# Altium schematic sheet Displays.SchDoc: Displays
size A4; Date: 2022 Fall; Address1: LK Bulls; Address2: Bagoly Zoltan; Address3: Feher Daniel; Address4: G. Varga Gabor; DocumentNumber: 4; Revision: 1.0; SheetNumber: 4; SheetTotal: 14
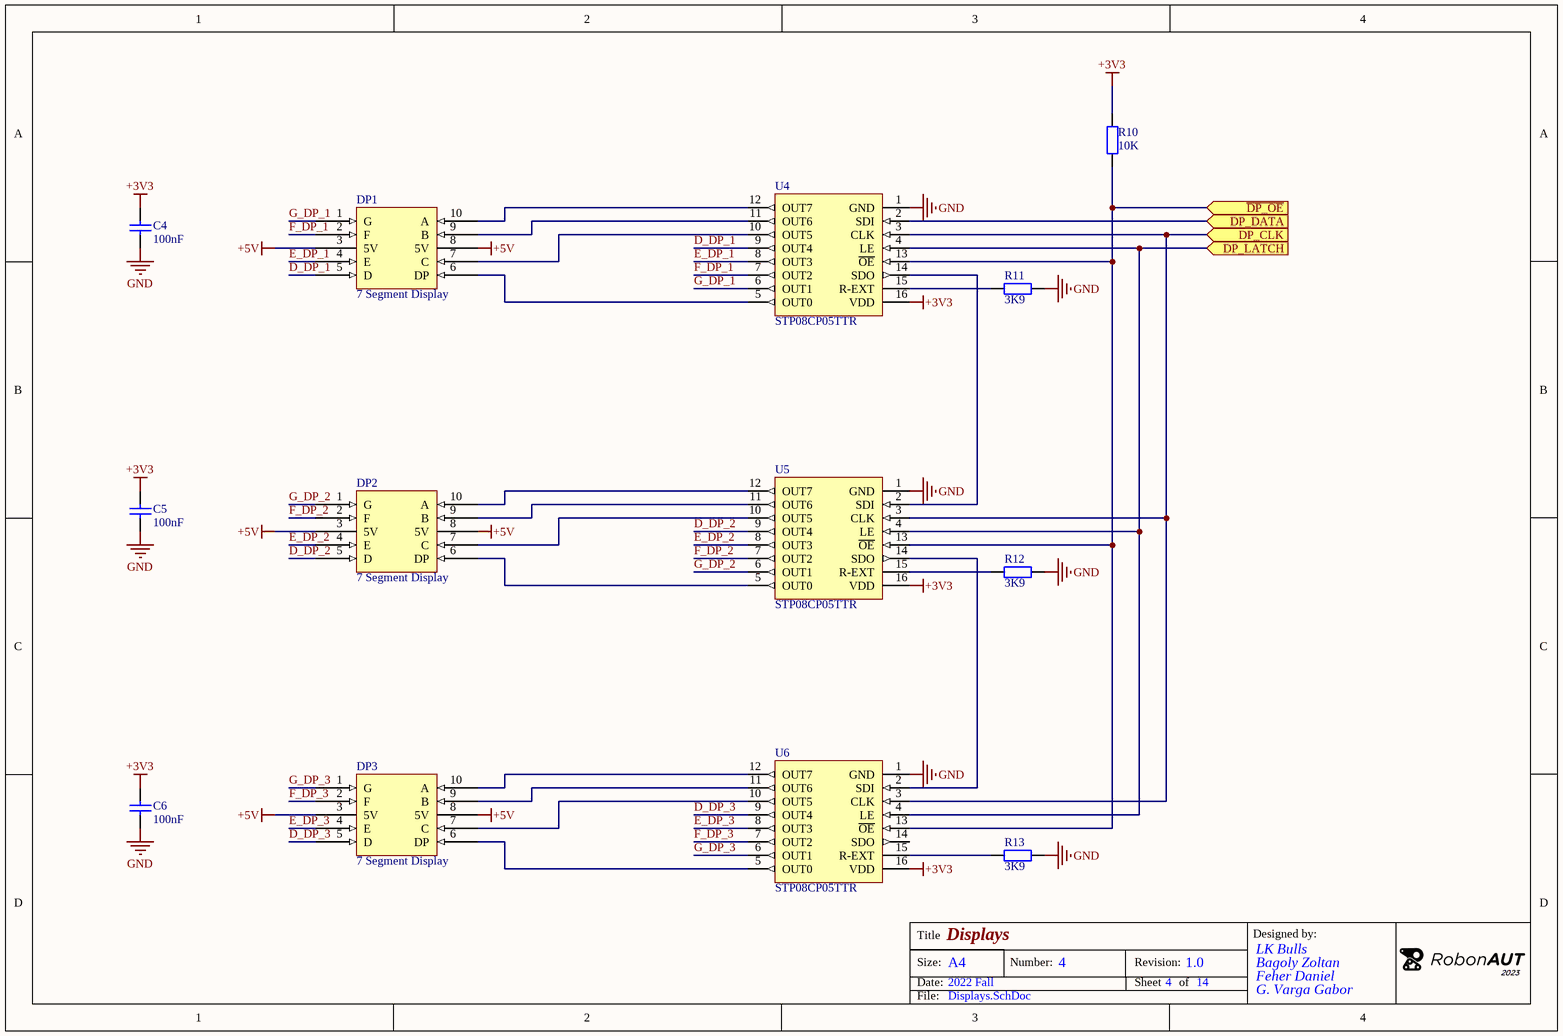
[diagram p0: Displays.SchDoc]

## Parts
C4  100nF  [FP_0805_CAP_085]
C5  100nF  [FP_0805_CAP_085]
C6  100nF  [FP_0805_CAP_085]
DP1  7 Segment Display  [FP_7_Segment_Display]
DP2  7 Segment Display  [FP_7_Segment_Display]
DP3  7 Segment Display  [FP_7_Segment_Display]
R10  10K  [FP_0805_RES]
R11  3K9  [FP_0805_RES]
R12  3K9  [FP_0805_RES]
R13  3K9  [FP_0805_RES]
U4  STP08CP05TTR  [SOP127P600-sajat_0095-015]
U5  STP08CP05TTR  [SOP127P600-sajat_0095-015]
U6  STP08CP05TTR  [SOP127P600-sajat_0095-015]

## Ports
DP_CLK (in), DP_DATA (in), DP_LATCH (in), ~{DP_OE} (in)

## Nets
+3V3: C4.2 C5.2 C6.2 R10.2 U4.16(VDD) U5.16(VDD) U6.16(VDD)
+5V: DP1.3(5V) DP1.8(5V) DP2.3(5V) DP2.8(5V) DP3.3(5V) DP3.8(5V)
GND: C4.1 C5.1 C6.1 R11.2 R12.2 R13.2 U4.1(GND) U5.1(GND) U6.1(GND)
~{DP_OE}: R10.1 U4.13(~{OE}) U5.13(~{OE}) U6.13(~{OE}) ; port ~{DP_OE}
D_DP_1: DP1.5(D) U4.9(OUT4)
D_DP_2: DP2.5(D) U5.9(OUT4)
D_DP_3: DP3.5(D) U6.9(OUT4)
DP_CLK: U4.3(CLK) U5.3(CLK) U6.3(CLK) ; port DP_CLK
DP_DATA: U4.2(SDI) ; port DP_DATA
DP_LATCH: U4.4(LE) U5.4(LE) U6.4(LE) ; port DP_LATCH
E_DP_1: DP1.4(E) U4.8(OUT3)
E_DP_2: DP2.4(E) U5.8(OUT3)
E_DP_3: DP3.4(E) U6.8(OUT3)
F_DP_1: DP1.2(F) U4.7(OUT2)
F_DP_2: DP2.2(F) U5.7(OUT2)
F_DP_3: DP3.2(F) U6.7(OUT2)
G_DP_1: DP1.1(G) U4.6(OUT1)
G_DP_2: DP2.1(G) U5.6(OUT1)
G_DP_3: DP3.1(G) U6.6(OUT1)
NetDP1_6: DP1.6(DP) U4.5(OUT0)
NetDP1_7: DP1.7(C) U4.10(OUT5)
NetDP1_9: DP1.9(B) U4.11(OUT6)
NetDP1_10: DP1.10(A) U4.12(OUT7)
NetDP2_6: DP2.6(DP) U5.5(OUT0)
NetDP2_7: DP2.7(C) U5.10(OUT5)
NetDP2_9: DP2.9(B) U5.11(OUT6)
NetDP2_10: DP2.10(A) U5.12(OUT7)
NetDP3_6: DP3.6(DP) U6.5(OUT0)
NetDP3_7: DP3.7(C) U6.10(OUT5)
NetDP3_9: DP3.9(B) U6.11(OUT6)
NetDP3_10: DP3.10(A) U6.12(OUT7)
NetR11_1: R11.1 U4.15(R-EXT)
NetR12_1: R12.1 U5.15(R-EXT)
NetR13_1: R13.1 U6.15(R-EXT)
NetU4_14: U4.14(SDO) U5.2(SDI)
NetU5_14: U5.14(SDO) U6.2(SDI)

Not connected (* = marked no-connect by the designer): U6 14(SDO)

## Notes on the sheet
- Title
- Size:
- Date:
- A4
- Number:
- Revision:
- Sheet
- of
- Designed by:
- File:

## Library data of the parts
C4-C6 = CAP: Capacitor; Tolerance: 10%; Voltage: 50V; Name: 100nF 0805 10% 50V X7R 0805B104K500NT (FNG); Supplier: Lomex; Reference: 82-13-46; Value: 100nF
DP1-DP3 = 7_Segment_Display: Name: FYS-3911BUHR-21 (FYL) 7 SEG SRED COM.AN. 10mm 30mcd 10x13x7mm 640nm; Supplier: Lomex; Reference: 35-03-94
R10 = RES: Resistor; Tolerance: 5%; Power: 0.125W; Name: 10K0 0805 5% CR-05JL7---10K 0.125W (VIK); Supplier: Lomex; Reference: 81-10-99; Value: 10K
R11-R13 = RES: Resistor; Tolerance: 5%; Power: 0.125W; Name: 3K90 0805 5% CR-05JL7---3K9 0.125W (VIK); Supplier: Lomex; Reference: 81-10-94; Value: 3K9
U4-U6 = STP08CP05TTR: Low voltage, low current power 8-bit shift register; Reference: Tanszék; Name: STP08CP05TTR, Counter Shift Registers Lo Vltg LoCurent Pwr 8B shift register; Supplier: Tanszék